# EAGLE design BLE-Shield-3_0_0_C1 (EAGLE 6.4)
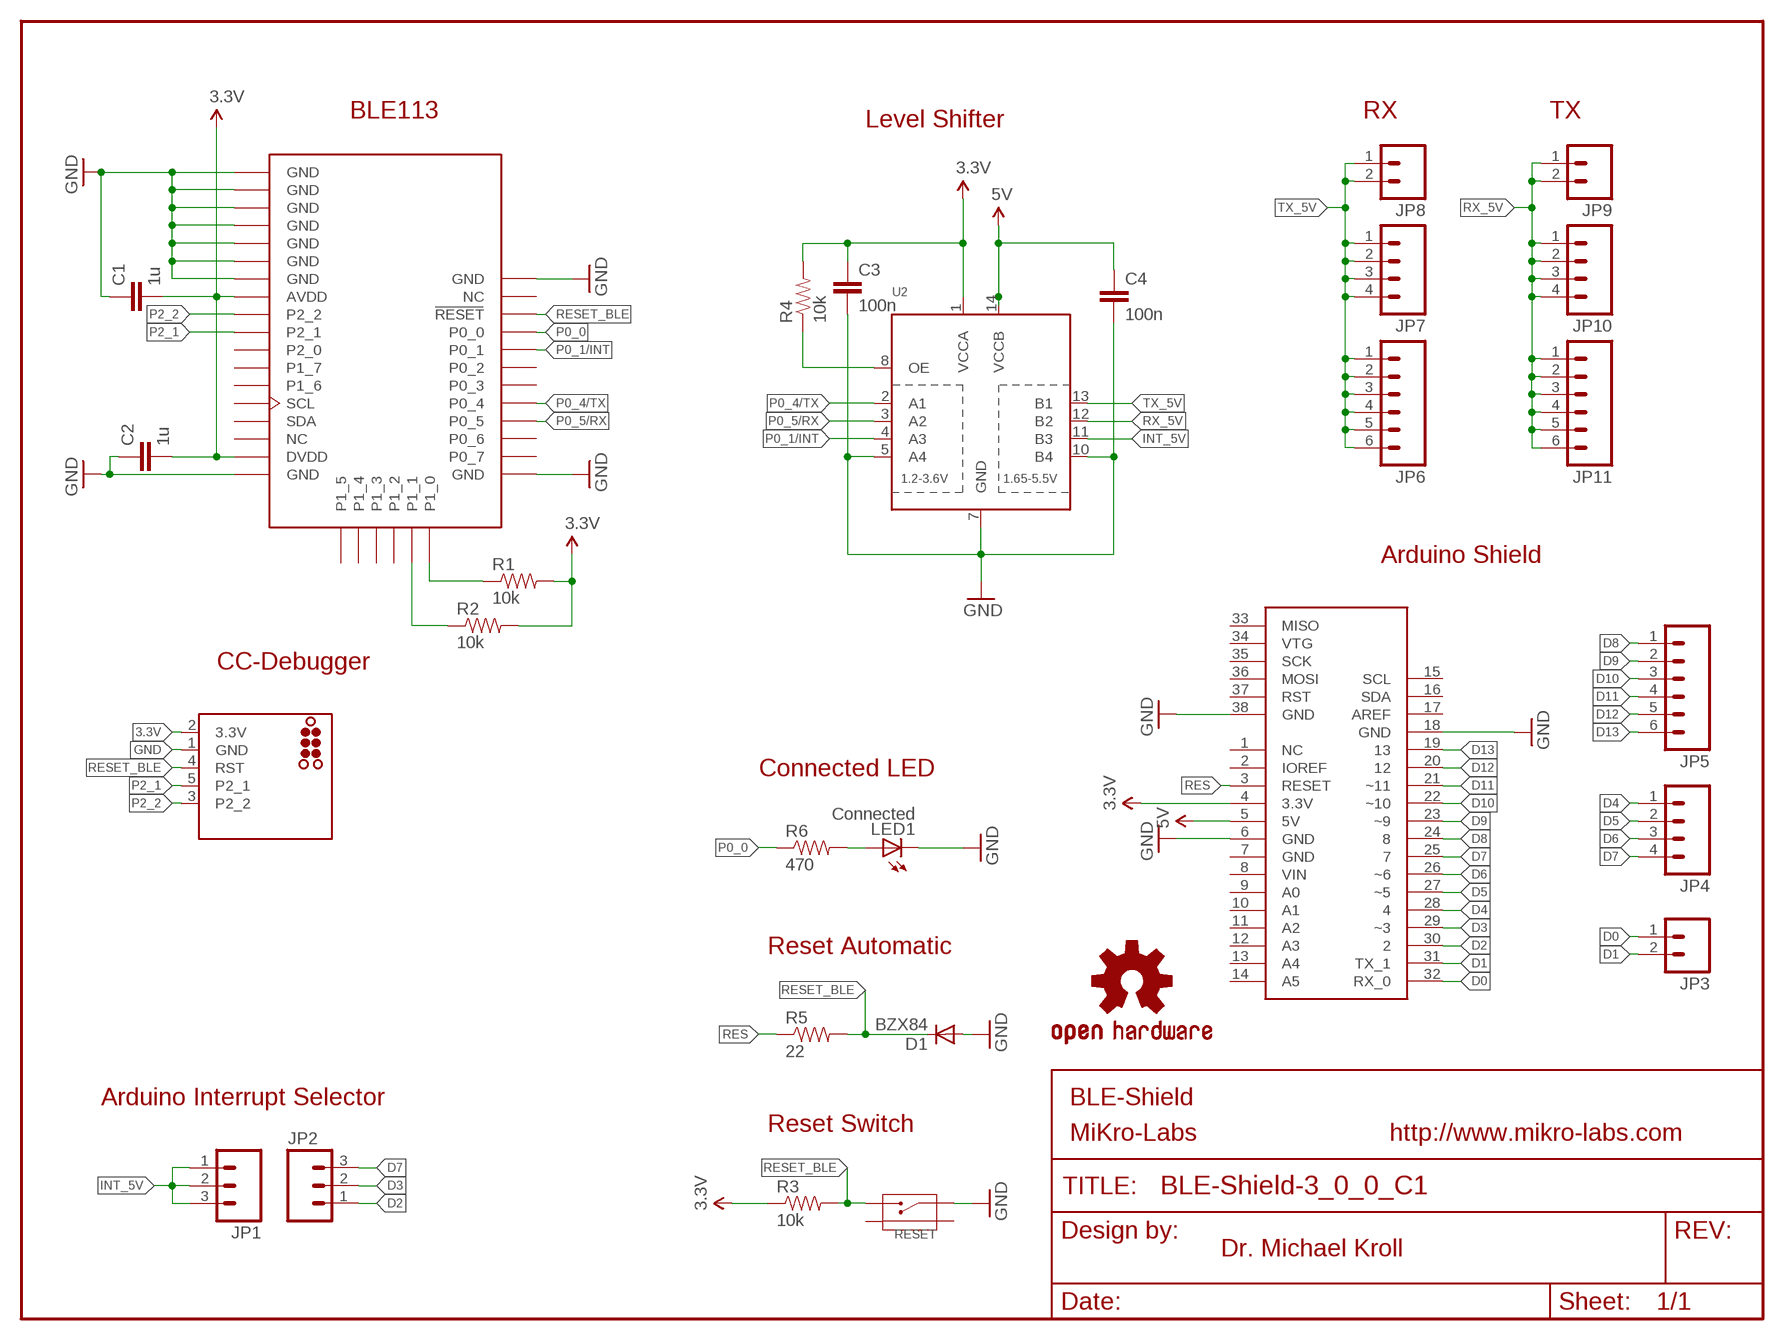
[diagram p0: schematic, sheet 1]

## Parts
C1  1u  CAP0603-CAP  [0603-CAP]
C2  1u  CAP0603-CAP  [0603-CAP]
C3  100n  CAP0603-CAP  [0603-CAP]
C4  100n  CAP0603-CAP  [0603-CAP]
CC-DEBUGGER  TC2030-CC-DEBUGGER  [TC2030-MCP-NL]
D1  BZX84  DIODESOT23  [SOT23-3]
FRAME1  FRAME-LETTER  [CREATIVE_COMMONS]
JP1  M03PTH  [1X03]
JP2  M03PTH  [1X03]
JP3  M02PTH  [1X02]
JP4  M04PTH  [1X04]
JP5  M06SIP  [1X06]
JP6  M06SIP  [1X06]
JP7  M04PTH  [1X04]
JP8  M02PTH  [1X02]
JP9  M02PTH  [1X02]
JP10  M04PTH  [1X04]
JP11  M06SIP  [1X06]
LED1  Connected  LED0603  [LED-0603]
LOGO1  OSHW-LOGOS  [OSHW-LOGO-S]
R1  10k  RESISTOR0603-RES  [0603-RES]
R2  10k  RESISTOR0603-RES  [0603-RES]
R3  10k  RESISTOR0603-RES  [0603-RES]
R4  10k  RESISTOR0603-RES  [0603-RES]
R5  22  RESISTOR0603-RES  [0603-RES]
R6  470  RESISTOR0603-RES  [0603-RES]
RESET  BUTTON-2P-REINFORCE-3100060P1  [4P-SMD-7.0X3.5X3.5H-90D]
U1  BLE113-A-VISUAL  [BLE113-A]
U2  TXB0104PWR  [TSSOP14]
U$1  ARDUINO_UNO_SHIELD_ICSP_PADS_ONLY  [ICSP_PADS_ONLY]

## Nets
3.3V: C1.2 C2.2 C3.1 CC-DEBUGGER.2(3.3V) R1.2 R2.2 R3.1 R4.2 U1.AVDD U1.DVDD U2.1(VCCA) U$1.4(3.3V)
5V: C4.1 U2.14(VCCB) U$1.5(5V)
D0: JP3.1 U$1.32(RX_0)
D1: JP3.2 U$1.31(TX_1)
D2: JP2.1 U$1.30
D3: JP2.2 U$1.29(~3)
D4: JP4.1 U$1.28
D5: JP4.2 U$1.27(~5)
D6: JP4.3 U$1.26(~6)
D7: JP2.3 JP4.4 U$1.25
D8: JP5.1 U$1.24
D9: JP5.2 U$1.23(~9)
D10: JP5.3 U$1.22(~10)
D11: JP5.4 U$1.21(~11)
D12: JP5.5 U$1.20
D13: JP5.6 U$1.19
GND: C1.1 C2.1 C3.2 C4.2 CC-DEBUGGER.1(GND) D1.1(A) LED1.C RESET.1 U1.GND U1.GND@2(GND) U1.GND@3(GND) U1.GND@4(GND) U1.GND@5(GND) U1.GND@6(GND) U1.GND@7(GND) U1.GND@8(GND) U1.GND@9(GND) U1.GND@10(GND) U2.5(A4) U2.7(GND) U2.10(B4) U$1.6(GND) U$1.18(GND) U$1.38(GND)
INT_5V: JP1.1 JP1.2 JP1.3 U2.11(B3)
N$2: LED1.A R6.2
N$4: R4.1 U2.8(OE)
N$7: R1.1 U1.P1_0
N$8: R2.1 U1.P1_1
P0_0: R6.1 U1.P0_0
P0_1/INT: U1.P0_1 U2.4(A3)
P0_4/TX: U1.P0_4 U2.2(A1)
P0_5/RX: U1.P0_5 U2.3(A2)
P2_1: CC-DEBUGGER.5(P2_1) U1.P2_1
P2_2: CC-DEBUGGER.3(P2_2) U1.P2_2
RES: R5.1 U$1.3(RESET)
RESET_BLE: CC-DEBUGGER.4(RST) D1.3(C) R3.2 R5.2 RESET.2 U1.RESET
RX_5V: JP9.1 JP9.2 JP10.1 JP10.2 JP10.3 JP10.4 JP11.1 JP11.2 JP11.3 JP11.4 JP11.5 JP11.6 U2.12(B2)
TX_5V: JP6.1 JP6.2 JP6.3 JP6.4 JP6.5 JP6.6 JP7.1 JP7.2 JP7.3 JP7.4 JP8.1 JP8.2 U2.13(B1)
Unconnected: RESET.S1 RESET.S2 U1.NC U1.NC@2(NC) U1.P0_2 U1.P0_3 U1.P0_6 U1.P0_7 U1.P1_2 U1.P1_3 U1.P1_4 U1.P1_5 U1.P1_6 U1.P1_7 U1.P2_0 U1.SCL U1.SDA U$1.1(NC) U$1.2(IOREF) U$1.7(GND) U$1.8(VIN) U$1.9(A0) U$1.10(A1) U$1.11(A2) U$1.12(A3) U$1.13(A4) U$1.14(A5) U$1.15(SCL) U$1.16(SDA) U$1.17(AREF) U$1.33(MISO) U$1.34(VTG) U$1.35(SCK) U$1.36(MOSI) U$1.37(RST)

## Notes on the sheet
- BLE113 | RX | TX
- Level Shifter
- Arduino Shield
- CC-Debugger
- Connected LED
- Reset Automatic
- Arduino Interrupt Selector | BLE-Shield
- Reset Switch
- MiKro-Labs | http://www.mikro-labs.com
- Dr. Michael Kroll

## Library data of the parts
C1-C4 = SparkFun-Capacitors:CAP: Capacitor Standard 0603 ceramic capacitor, and 0.1" leaded capacitor.
CC-DEBUGGER = Tag-Connect:TC2030-CC-DEBUGGER: Arduino TAG-CONNECT ICSP Connector Manufacturer: Tag-Connect <http://www.tag-connect.com> Cable for easy Arduino In-Circuit Bootloader and Sketch Programming. PAD Description 1 MISO 2 VCC 3 SCK 4 MOSI 5 RST 6 GND ©2013 http://www.mkroll.mobi - modified and updated by Dr. Michael Kroll ‹dr.michael.kroll@gmail.com›
D1 = SparkFun-DiscreteSemi:DIODE: Diode These are standard reverse protection diodes and small signal diodes. SMA package can handle up to about 1A. SOD-323 can handle about 200mA. What the SOD-323 package when ordering, there are some mfgs out there that are 5-pin packages.
FRAME1 = SparkFun-Aesthetics:FRAME-LETTER: Schematic Frame Standard 8.5x11 US Letter frame
JP1 JP2 = SparkFun-Connectors:M03: Header 3 Standard 3-pin 0.1" header. Use with straight break away headers (SKU : PRT-00116), right angle break away headers (PRT-00553), swiss pins (PRT-00743), machine pins (PRT-00117), and female headers (PRT-00115). Molex polarized connector foot print use with SKU : PRT-08232 with associated crimp pins and housings.
JP3 JP8 JP9 = SparkFun-Connectors:M02: Header 2 Standard 2-pin 0.1" header. Use with straight break away headers (SKU : PRT-00116), right angle break away headers (PRT-00553), swiss pins (PRT-00743), machine pins (PRT-00117), and female headers (PRT-00115). Molex polarized connector foot print use with SKU : PRT-08233 with associated crimp pins and housings.
JP4 JP7 JP10 = SparkFun-Connectors:M04: Header 4 Standard 4-pin 0.1" header. Use with straight break away headers (SKU : PRT-00116), right angle break away headers (PRT-00553), swiss pins (PRT-00743), machine pins (PRT-00117), and female headers (PRT-00115). Molex polarized connector foot print use with SKU : PRT-08231 with associated crimp pins and housings. 1MM SMD Version SKU: PRT-10208
JP5 JP6 JP11 = SparkFun-Connectors:M06: Header 6 Standard 6-pin 0.1" header. Use with straight break away headers (SKU : PRT-00116), right angle break away headers (PRT-00553), swiss pins (PRT-00743), machine pins (PRT-00117), and female headers (PRT-00115). Molex polarized connector foot print use with SKU : PRT-08094 with associated crimp pins and housings. NOTES ON THE VARIANTS LOCK and LOCK_LONGPADS... This footprint was designed to help hold the alignment of a through-hole component (i.e. 6-pin header) while soldering it into place. You may notice that each hole has been shifted either up or down by 0.005 of an inch from it's more standard position (which is a perfectly straight line). This slight alteration caused the pins (the squares in the middle) to touch the edges of the holes. Because they are alternating, it causes a "brace" to hold the component in place. 0.005 has proven to be the perfect amount of "off-center" position when using our standard breakaway headers. Although looks a little odd when you look at the bare footprint, once you have a header in there, the alteration is very hard to notice. Also, if you push a header all the way into place, it is covered up entirely on the bottom side. This idea of altering the position of holes to aid alignment will be further integrated into the Sparkfun Library for other footprints. It can help hold any component with 3 or more connection pins.
LED1 = SparkFun-LED:LED: LEDs Standard schematic elements and footprints for 5mm, 3mm, 1206, and 0603 sized LEDs. 5mm - Spark Fun Electronics SKU : COM-00529 (and others)
LOGO1 = SparkFun-Aesthetics:OSHW-LOGO: Open Source Hardware Logo This logo indicates the piece of hardware it is found on incorporates a OSHW license and/or adheres to the definition of open source hardware found here: http://freedomdefined.org/OSHW
R1-R6 = SparkFun-Resistors:RESISTOR: Resistor Basic schematic elements and footprints for 0603, 1206, and PTH resistors.
RESET = OPL:BUTTON-2P-REINFORCE: TS-1188E http://www.best-dz.com/?thread-374-2.html SMD Button
U1 = sf-bluegiga:BLE113-A-VISUAL: Bluetooth Low Energy single-mode module - Bluetooth 4.0, chip antenna (CC2541)
U2 = adafruit:TXB0104PWR: 4-Bit Bi-Directional Level Shifter 1.2V-3.6V (VCCA) to 1.65V-5.5V (VCCB) bi-directional level shifter with auto direction sensing. Max data rate - VCCA 1.8V: 20Mbps (50ns), VCCA 3.3V: 100Mbps (10ns) Digikey: 296-21929-1-ND
U$1 = Arduino_Shields:ARDUINO_UNO_SHIELD_ICSP: Arduino Uno R3 Shield with ICSP header.

## Board
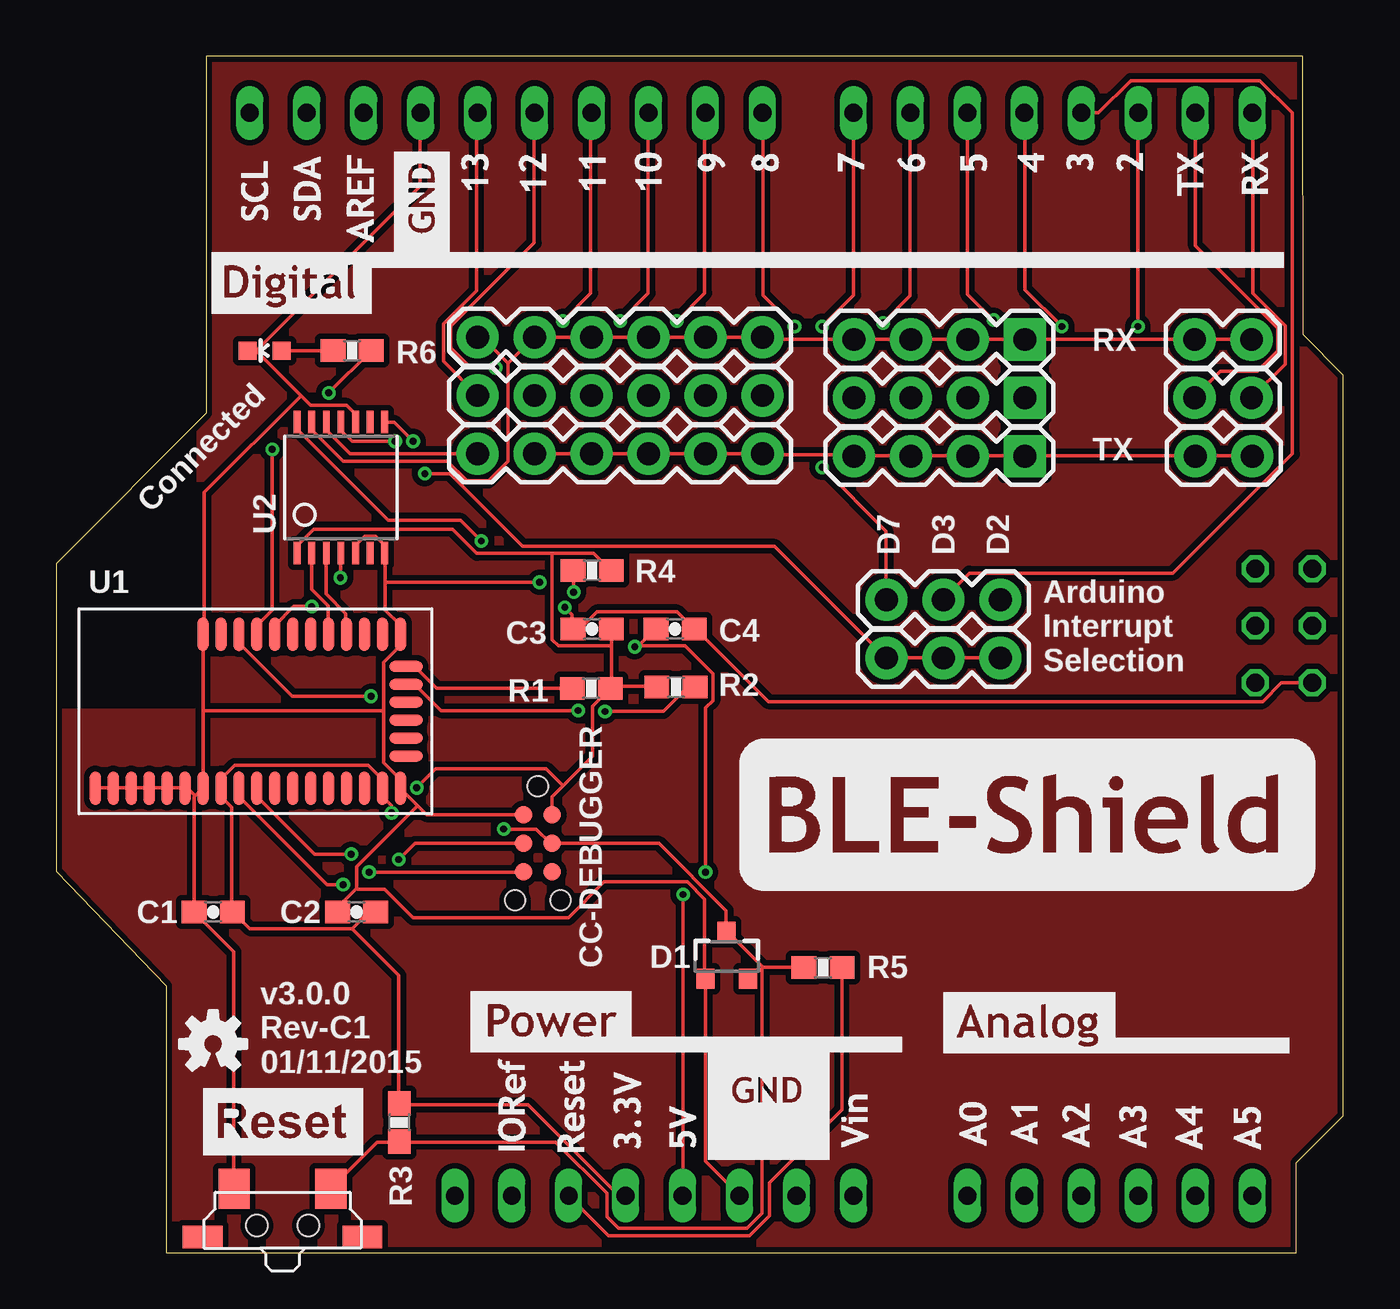
[diagram p1: board, top side]
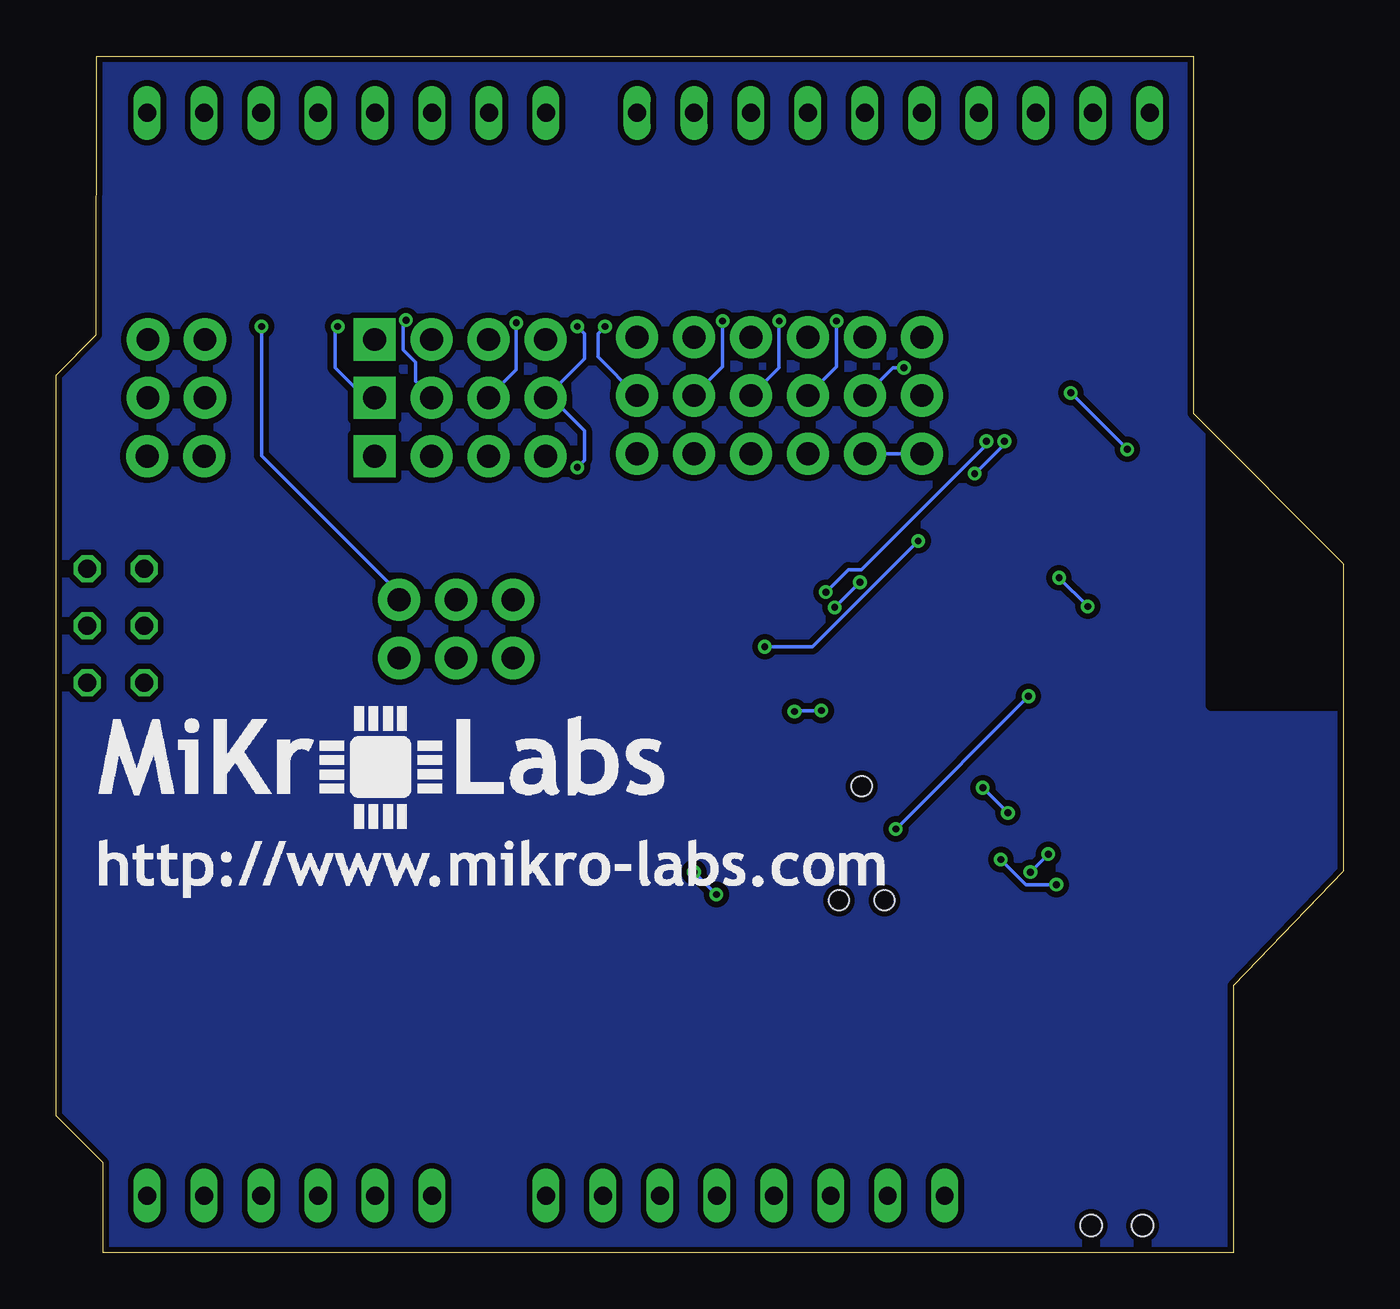
[diagram p2: board, bottom side, seen from below]

Size 57.4 x 53.33 mm. Coordinates in mm from the lower left corner, seen from the top.
Outline: 4.9,0 55.3,0 55.3,4 57.4,6.1 57.4,39.1 55.6,40.9 55.59,53.33 6.7,53.33 6.7,37.4 0,30.7 0,17 4.9,11.9 4.9,0
Copper layers (1*2*15*16): Top 0.035mm / dielectric 0.2mm / layer 2 0.0175mm / dielectric 1.1mm / layer 15 0.0175mm / dielectric 0.2mm / Bottom 0.035mm
Design rules "SeeedStudio_DRU_no_angle_20130527": minimum track width 6mil, minimum drill 12mil, track to track 6mil, track to pad 6mil, pad to pad 6mil, via to via 6mil, smd to smd 0mil, copper to edge 10mil, drill to drill 10mil, minimum pad ring 6mil, minimum via ring 6mil, stop-mask expansion 2mil, vias tented up to drill 25mil, thermal gap 10mil
tRestrict: area 0,24.5 to 6,37.6
bRestrict: area 0.1,24.4 to 5.9,37.5

### Footprints (pad centres in the part's own frame; a part is rotated, then mirrored left to right if it is on the bottom)
0603-CAP = smd 1.1 x 1: 1 -0.85,0; 2 0.85,0
TC2030-MCP-NL = smd 0.787 x 0.787: 1 1.27,-0.635; 2 1.27,0.635; 3 2.54,-0.635; 4 2.54,0.635; 5 3.81,-0.635; 6 3.81,0.635 | hole 0.889: 0,0; 5.08,-1.016; 5.08,1.016
SOT23-3 = smd 0.8 x 0.9: 1 -0.95,-1; 2 0.95,-1; 3 0,1.1
1X03 = drill 1.016 pad 1.88: 1 0,0; 2 2.54,0; 3 5.08,0
1X02 = drill 1.016 pad 1.88: 1 0,0; 2 2.54,0
1X04 = drill 1.016 pad 1.88 square: 1 0,0 | drill 1.016 pad 1.88: 2 2.54,0; 3 5.08,0; 4 7.62,0
1X06 = drill 1.016 pad 1.88: 1 0,0; 2 2.54,0; 3 5.08,0; 4 7.62,0; 5 10.16,0; 6 12.7,0
LED-0603 = smd 0.8 x 0.8: A 0,-0.75; C 0,0.75
0603-RES = smd 1.1 x 1: 1 -0.85,0; 2 0.85,0
4P-SMD-7.0X3.5X3.5H-90D = smd 1.397 x 1.778: 1 -2.159,1.651; 2 2.159,1.651 | smd 1.778 x 1.016: S1 -3.556,-0.508; S2 3.556,-0.508 | hole 0.95: -1.15,0; 1.15,0
BLE113-A = smd 1.5 x 0.5: AVDD -3.425,1.538; DVDD -3.425,-5.662; GND -3.425,7.138; GND@2 -3.425,6.338; GND@3 -3.425,5.537; GND@4 -3.425,4.737; GND@5 -3.425,3.938; GND@6 -3.425,3.138; GND@7 -3.425,2.337; GND@8 -3.425,-6.463; GND@9 3.425,-6.463; GND@10 3.425,2.337; NC -3.425,-4.862; NC@2 3.425,1.538; P0_0 3.425,-0.062; P0_1 3.425,-0.863; P0_2 3.425,-1.663; P0_3 3.425,-2.462; P0_4 3.425,-3.263; P0_5 3.425,-4.062; P0_6 3.425,-4.862; P0_7 3.425,-5.662; P1_6 -3.425,-2.462; P1_7 -3.425,-1.663; P2_0 -3.425,-0.863; P2_1 -3.425,-0.062; P2_2 -3.425,0.738; RESET 3.425,0.738; SCL -3.425,-3.263; SDA -3.425,-4.062 | smd 0.5 x 1.5: P1_0 2,-6.713; P1_1 1.2,-6.713; P1_2 0.4,-6.713; P1_3 -0.4,-6.713; P1_4 -1.2,-6.713; P1_5 -2,-6.713
TSSOP14 = smd 0.305 x 0.991: 1 -1.95,-2.918; 2 -1.3,-2.918; 3 -0.65,-2.918; 4 0,-2.918; 5 0.65,-2.918; 6 1.3,-2.918; 7 1.95,-2.918; 8 1.95,2.918; 9 1.3,2.918; 10 0.65,2.918; 11 0,2.918; 12 -0.65,2.918; 13 -1.3,2.918; 14 -1.95,2.918
ICSP_PADS_ONLY = drill 0.8 long: 1 27.94,2.54; 2 30.48,2.54; 3 33.02,2.54; 4 35.56,2.54; 5 38.1,2.54; 6 40.64,2.54; 7 43.18,2.54; 8 45.72,2.54; 9 50.8,2.54; 10 53.34,2.54; 11 55.88,2.54; 12 58.42,2.54; 13 60.96,2.54; 14 63.5,2.54; 15 18.796,50.8; 16 21.336,50.8; 17 23.876,50.8; 18 26.416,50.8; 19 28.956,50.8; 20 31.496,50.8; 21 34.036,50.8; 22 36.576,50.8; 23 39.116,50.8; 24 41.656,50.8; 25 45.72,50.8; 26 48.26,50.8; 27 50.8,50.8; 28 53.34,50.8; 29 55.88,50.8; 30 58.42,50.8; 31 60.96,50.8; 32 63.5,50.8 | drill 0.8 octagon: 33 63.627,30.48; 34 66.167,30.48; 35 63.627,27.94; 36 66.167,27.94; 37 63.627,25.4; 38 66.167,25.4

### Placement (x,y rotation side)
C1  7.01,15.18 0 top
C2  13.4,15.18 0 top
C3  23.9,27.8 180 top
C4  27.6,27.8 0 top
CC-DEBUGGER  21.48,20.78 270 top
D1  29.9,13.2 0 top
FRAME1  0,0 0 top
JP1  42.1,26.5 180 top
JP2  42.1,29.1 180 top
JP3  53.3,38.1 180 top
JP4  43.2,38.1 180 top
JP5  31.5,38.2 180 top
JP6  31.5,40.8 180 top
JP7  43.2,40.7 180 top
JP8  53.3,40.7 180 top
JP9  50.8,35.5 0 top
JP10  43.2,35.5 180 top
JP11  31.5,35.6 180 top
LED1  9.3,40.2 90 top
LOGO1  7,9.3 0 top
R1  23.86,25.15 0 top
R2  27.64,25.21 180 top
R3  15.3,5.8 270 top
R4  23.9,30.4 0 top
R5  34.2,12.7 180 top
R6  13.2,40.2 180 top
RESET  10.1,1.2 0 top
U1  8.89,24.13 90 top
U2  12.7,34.1 0 top
U$1  -10.16,0 0 top
U$2  [DIGITAL]  6.9,41.8 0 top
U$3  [POWER-ANALOG]  18.7,4.3 0 top
U$4  [MIKROLABS-URL]  55.9,15.3 0 bottom
U$5  [MIKROLABS-LOGO]  55.8,18.3 0 bottom
U$6  [BLE-SHIELD]  30,15.6 0 top
U$7  [RESET]  6.5,4.3 0 top

### Tracks (layer width: path | path; a pad name or v marks a point on that pad's centre or on a via)
3.3V  (via drill 0.3)
  Top 0.152: 22.6,20.8 23.92,22.12 23.92,24.36 R1.2 | 22.6,20.8 22.12,20.32 CC-DEBUGGER.2 | 24.76,27.04 24.76,25.2 R1.2 | 24.76,27.04 C3.1 | R2.2 26.76,25.24 24.8,25.24 R1.2 | 22.12,31.16 23.96,31.16 24.72,30.4 R4.2 | 22.12,31.16 18.76,31.16 17.68,32.24 11.48,32.24 10.76,31.52 10.76,31.2 U2.1 | 24.76,27.04 22.4,27.04 22.12,27.32 22.12,31.16 | 13.2,14.44 13.92,15.16 14.24,15.16 C2.2 | 13.2,14.44 8.64,14.44 7.92,15.16 C1.2 7.84,15.2 7.84,19.84 7.36,20.32 7.36,20.68 U1.AVDD 7.4,20.76 7.4,21.16 7.96,21.72 13.92,21.72 14.52,21.12 14.52,20.72 U1.DVDD 14.56,20.64 14.56,20.32 14.96,19.92 v14.96,19.6 | 13.2,14.44 15.28,12.36 15.28,6.68 R3.1 15.36,6.6 21.04,6.6 25.08,2.56 25.4,2.56 U$1.4 | 22.6,20.8 21.84,21.56 16.92,21.56 v16.08,20.72
  Bottom 0.152: v14.96,19.6 v16.08,20.72
5V  (via drill 0.3)
  Top 0.152: v18.96,31.72 18.04,32.64 14.8,32.64 10.76,36.68 10.76,37 U2.14 | C4.1 26.72,27.8 25.92,27 v25.8,27 26.04,27.04 28.04,27.04 29.28,25.8 29.28,24.6 28.96,24.28 v28.96,16.96 | v27.96,15.96 27.96,2.56 U$1.5
  Bottom 0.152: v18.96,31.72 23.68,27 v25.8,27 | v28.96,16.96 v27.96,15.96
D0
  Top 0.152: JP3.1 54.8,39.6 54.8,41.32 53.36,42.76 53.36,50.8 U$1.32
D1
  Top 0.152: U$1.31 50.8,44.88 54.48,41.2 54.48,40.2 53.56,39.28 51.92,39.28 50.76,38.12 JP3.2
D2  (via drill 0.3)
  Top 0.152: v48.24,41.28 48.24,50.8 U$1.30
  Bottom 0.152: v48.24,41.28 48.24,35.52 42.12,29.4 42.12,29.12 JP2.1
D3
  Top 0.152: U$1.29 46.48,50.8 47.92,52.24 53.68,52.24 55.12,50.8 55.12,35.6 49.8,30.28 40.72,30.28 39.56,29.12 JP2.2
D4  (via drill 0.3)
  Top 0.152: v44.84,41.28 43.2,42.92 43.2,50.8 U$1.28
  Bottom 0.152: v44.84,41.28 44.96,41.16 44.96,39.44 43.64,38.12 43.2,38.12 JP4.1
D5  (via drill 0.3)
  Top 0.152: U$1.27 40.64,42.72 v41.8,41.56
  Bottom 0.152: v41.8,41.56 41.92,41.44 41.92,40.24 41.36,39.68 41.36,38.84 40.64,38.12 JP4.2
D6  (via drill 0.3)
  Top 0.152: v36.88,41.44 38.08,42.64 38.08,50.8 U$1.26
  Bottom 0.152: v36.88,41.44 36.88,39.36 38.12,38.12 JP4.3
D7  (via drill 0.3)
  Top 0.152: U$1.25 35.56,42.68 v34.16,41.28 | v34.16,35 37,32.16 37,29.12 JP2.3
  Bottom 0.152: v34.16,41.28 33.84,40.96 33.84,39.84 JP4.4 35.4,38.2 33.84,36.64 33.84,35.32 v34.16,35
D8  (via drill 0.3)
  Top 0.152: v32.92,41.28 31.52,42.68 31.52,50.8 U$1.24
  Bottom 0.152: v32.92,41.28 33.24,40.96 33.24,39.92 31.52,38.2 JP5.1
D9  (via drill 0.3)
  Top 0.152: v27.68,41.52 28.92,42.76 28.92,50.8 U$1.23
  Bottom 0.152: v27.68,41.52 27.68,39.48 JP5.2
D10  (via drill 0.3)
  Top 0.152: v25.16,41.52 26.4,42.76 26.4,50.8 U$1.22
  Bottom 0.152: v25.16,41.52 25.16,39.44 26.4,38.2 JP5.3
D11  (via drill 0.3)
  Top 0.152: v22.6,41.52 23.84,42.76 23.84,50.8 U$1.21
  Bottom 0.152: v22.6,41.52 22.6,39.48 JP5.4
D12  (via drill 0.3)
  Top 0.152: v19.6,39.44 18.48,39.44 17.6,40.32 17.6,41.28 21.32,45 21.32,50.8 U$1.20
  Bottom 0.152: v19.6,39.44 20.08,39.44 21.32,38.2 JP5.5
D13
  Top 0.152: JP5.6 17.28,39.72 17.28,41.4 18.76,42.88 18.76,50.8 U$1.19
GND  (via drill 0.3)
  Top 0.152: 8.92,40.2 LED1.C | 10.92,38.2 11.36,37.76 12.96,37.76 13.32,37.4 13.32,37.04 U2.10 | 10.92,38.2 8.92,40.2 | 8.92,40.2 16.24,47.52 16.24,50.8 U$1.18 | 4.96,20.72 U1.GND@5 | 4.16,20.72 U1.GND@4 | 3.36,20.72 U1.GND@3 | 1.76,20.72 U1.GND 1.84,20.72 2.52,20.72 U1.GND@2 | 2.56,20.72 U1.GND@2 | U1.GND@3 3.28,20.72 2.64,20.72 U1.GND@2 | U1.GND@4 4.08,20.72 3.44,20.72 U1.GND@3 | U1.GND@5 4.88,20.72 4.24,20.72 U1.GND@4 | U1.GND@10 | 5.76,20.72 U1.GND@6 | 6.2,20.36 6.52,20.68 U1.GND@7 | 6.2,20.36 6.16,20.32 C1.1 6.2,15.12 7.92,13.4 7.92,2.88 RESET.1 | 6.2,20.36 5.84,20.72 U1.GND@6 | 6.56,20.72 U1.GND@7 | 6.56,24.16 6.56,20.8 U1.GND@7 | 6.56,24.16 6.56,27.48 U1.GND@10 | U1.GND@5 5.04,20.72 5.68,20.72 U1.GND@6 | 10.92,38.2 6.6,33.88 6.6,27.6 U1.GND@10 | U$1.38 54.64,25.4 53.8,24.56 31.76,24.56 28.52,27.8 C4.2 27.68,28.56 24.12,28.56 23.36,27.8 C3.2 23,27.84 23,28.44 v22.68,28.76 | U$1.6 30.48,2.56 28.96,4.08 D1.1 28.92,12.24 28.92,15.76 28.16,16.52 24.44,16.52 22.84,14.92 15.92,14.92 14.64,16.2 13.44,16.2 13.4,16.24 | U2.5 13.36,31.2 13.36,31.52 13.76,31.92 14.24,31.92 14.64,31.52 14.64,31.2 U2.7 14.68,31.12 14.68,29.88 | 14.68,29.88 14.68,28.64 15.32,28 15.32,27.56 U1.GND@9 | U1.GND@9 | 16.12,19.92 15.36,20.68 U1.GND@8 | 16.12,19.92 16.52,19.52 CC-DEBUGGER.1 | 13.4,16.24 12.56,15.4 12.56,15.2 C2.1 | 13.4,16.24 13.4,17.2 16.12,19.92 | 15.36,20.72 U1.GND@8 | 14.6,24.16 14.6,21.84 15.36,21.08 15.36,20.8 U1.GND@8 | 14.6,24.16 14.6,26.32 15.36,27.08 15.36,27.48 U1.GND@9 | 14.68,29.88 v21.56,29.88 | 14.6,24.16 6.56,24.16
  Bottom 0.152: v21.56,29.88 v22.68,28.76
INT_5V  (via drill 0.3)
  Top 0.152: v15.12,36.16 13.2,36.16 12.72,36.64 12.72,37 U2.11 | v16.44,34.72 17.56,34.72 20.8,31.48 32.04,31.48 JP1.3 37.08,26.52 39.56,26.52 JP1.2 39.6,26.52 42.08,26.52 JP1.1
  Bottom 0.152: v15.12,36.16 15.12,36.04 v16.44,34.72
N$1
  pour Top (isolate 0.254): 6.7,53.3 55.6,53.3 55.6,40.9 57.4,39.1 57.4,6.1 55.3,4 55.3,0 4.9,0 4.9,11.8 0,16.7 0,30.7 6.7,37.4
N$2
  Top 0.152: R6.2 LED1.A
N$3
  pour Bottom (isolate 0.254): 6.7,53.3 55.6,53.3 55.6,40.9 57.4,39.1 57.4,6.1 55.3,4 55.3,0 4.9,0 4.9,11.9 0,16.8 0,30.6 6.7,37.3
N$4  (via drill 0.3)
  Top 0.152: v15.92,36.16 15.08,37 14.68,37 U2.8 | v23.08,29.44 23.08,30.4 R4.1
  Bottom 0.152: v15.92,36.16 15.92,36 21.48,30.44 22.08,30.44 v23.08,29.44
N$7
  Top 0.152: R1.1 16.96,25.16 16,26.12 15.64,26.12 U1.P1_0
N$8  (via drill 0.3)
  Top 0.152: v24.48,24.12 27.08,24.12 28.16,25.2 R2.1 | v23.28,24.16 17.16,24.16 16,25.32 15.64,25.32 U1.P1_1
  Bottom 0.152: v24.48,24.12 24.44,24.16 v23.28,24.16
P0_0  (via drill 0.3)
  Top 0.152: v12.16,38.32 R6.1 | v9.64,35.8 9.64,28.64 8.96,27.96 U1.P0_0
  Bottom 0.152: v9.64,35.8 v12.16,38.32
P0_1/INT  (via drill 0.3)
  Top 0.152: v12.68,30.08 12.68,31.16 U2.4 | v11.4,28.8 10.6,28.8 9.76,27.96 U1.P0_1
  Bottom 0.152: v11.4,28.8 v12.68,30.08
P0_4/TX
  Top 0.152: U2.2 11.4,29.56 12.12,28.84 12.12,27.56 U1.P0_4
P0_5/RX
  Top 0.152: U2.3 12.04,31.16 12.04,29.36 12.92,28.48 12.92,27.56 U1.P0_5
P2_1  (via drill 0.3)
  Top 0.152: v13.96,16.96 CC-DEBUGGER.5 | v13.16,17.76 11.52,17.76 8.96,20.32 8.96,20.68 U1.P2_1
  Bottom 0.152: v13.16,17.76 v13.96,16.96
P2_2  (via drill 0.3)
  Top 0.152: CC-DEBUGGER.3 16,18.24 v15.28,17.52 | v12.8,16.4 12.08,16.4 8.16,20.32 8.16,20.68 U1.P2_2
  Bottom 0.152: v15.28,17.52 14.16,16.4 v12.8,16.4
RES
  Top 0.152: U$1.3 24.64,0.76 30.92,0.76 31.8,1.64 31.8,3.12 35.04,6.36 35.04,12.68 R5.1
RESET_BLE  (via drill 0.3)
  Top 0.152: RESET.2 12.28,2.88 14.32,4.92 15.28,4.92 R3.2 15.36,4.92 22.28,4.92 24.56,2.64 24.56,1.6 25.08,1.08 30.8,1.08 31.48,1.76 31.48,12.68 31.52,12.72 | 31.52,12.72 33.32,12.72 R5.2 | 31.52,12.72 29.96,14.28 D1.3 29.88,14.32 29.88,15.24 26.88,18.24 CC-DEBUGGER.4 22.04,18.24 21.4,18.88 v19.96,18.88 | v14.04,24.8 10.52,24.8 8.16,27.16 8.16,27.52 U1.RESET
  Bottom 0.152: v19.96,18.88 v14.04,24.8
RX_5V
  Top 0.152: JP11.6 13.12,35.6 12.08,36.64 12.08,37 U2.12 | JP11.5 JP11.4 JP11.3 JP11.2 JP11.1 31.56,35.56 35.56,35.56 JP10.4 35.6,35.52 38.12,35.52 JP10.3 38.16,35.52 40.64,35.52 JP10.2 40.72,35.52 43.2,35.52 JP10.1 43.24,35.52 50.76,35.52 JP9.1 50.8,35.52 53.32,35.52 JP9.2
  Bottom 0.152: JP11.5 JP11.6
TX_5V
  Top 0.152: JP8.1 53.28,40.72 50.76,40.72 JP8.2 50.72,40.72 43.24,40.72 JP7.1 43.2,40.72 40.72,40.72 JP7.2 40.64,40.72 38.16,40.72 JP7.3 38.12,40.72 35.6,40.72 JP7.4 35.52,40.72 31.6,40.72 31.56,40.76 JP6.1 JP6.2 JP6.3 JP6.4 JP6.5 21.32,40.8 20.16,39.64 | U2.13 11.4,36.68 12.8,35.28 17.44,35.28 18.32,34.4 19.28,34.4 20.16,35.28 20.16,39.64 | JP6.6 19,40.8 20.16,39.64

### Text on the board
tNames: RX / / TX | D7 / D3 / D2 | Arduino / Interrupt / Selection | v3.0.0 / Rev-C1 / 01/11/2015